# EAGLE board 140182-1-v2.1-j2b-synth (EAGLE 6.6.0)
AUTHOR: CPV; COPYRIGHT: (C) Elektor; NRS: 140182-1; REV: v2.1
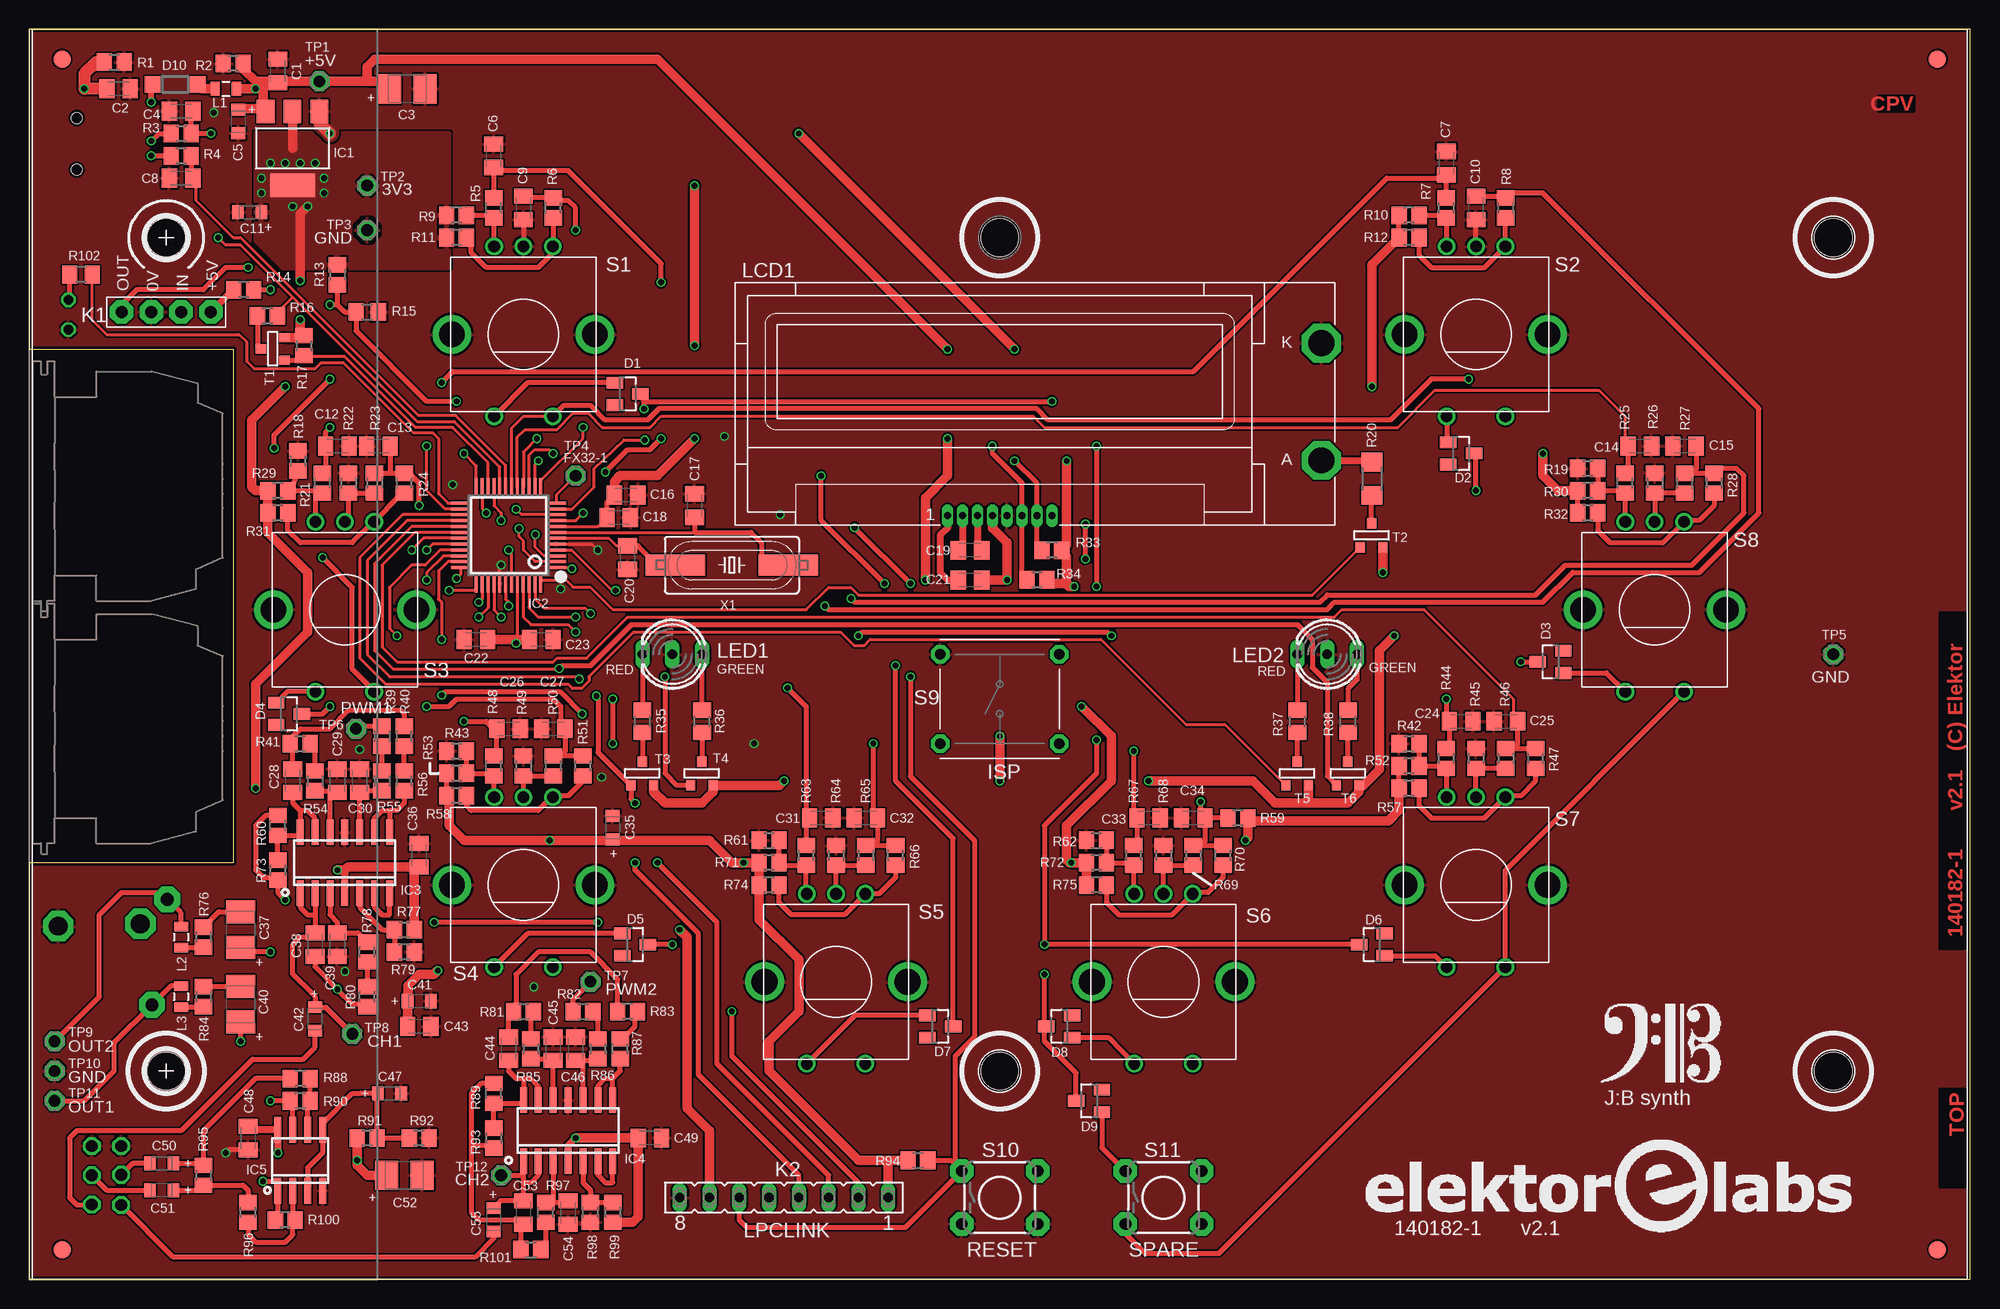
[diagram p6: board, top side]
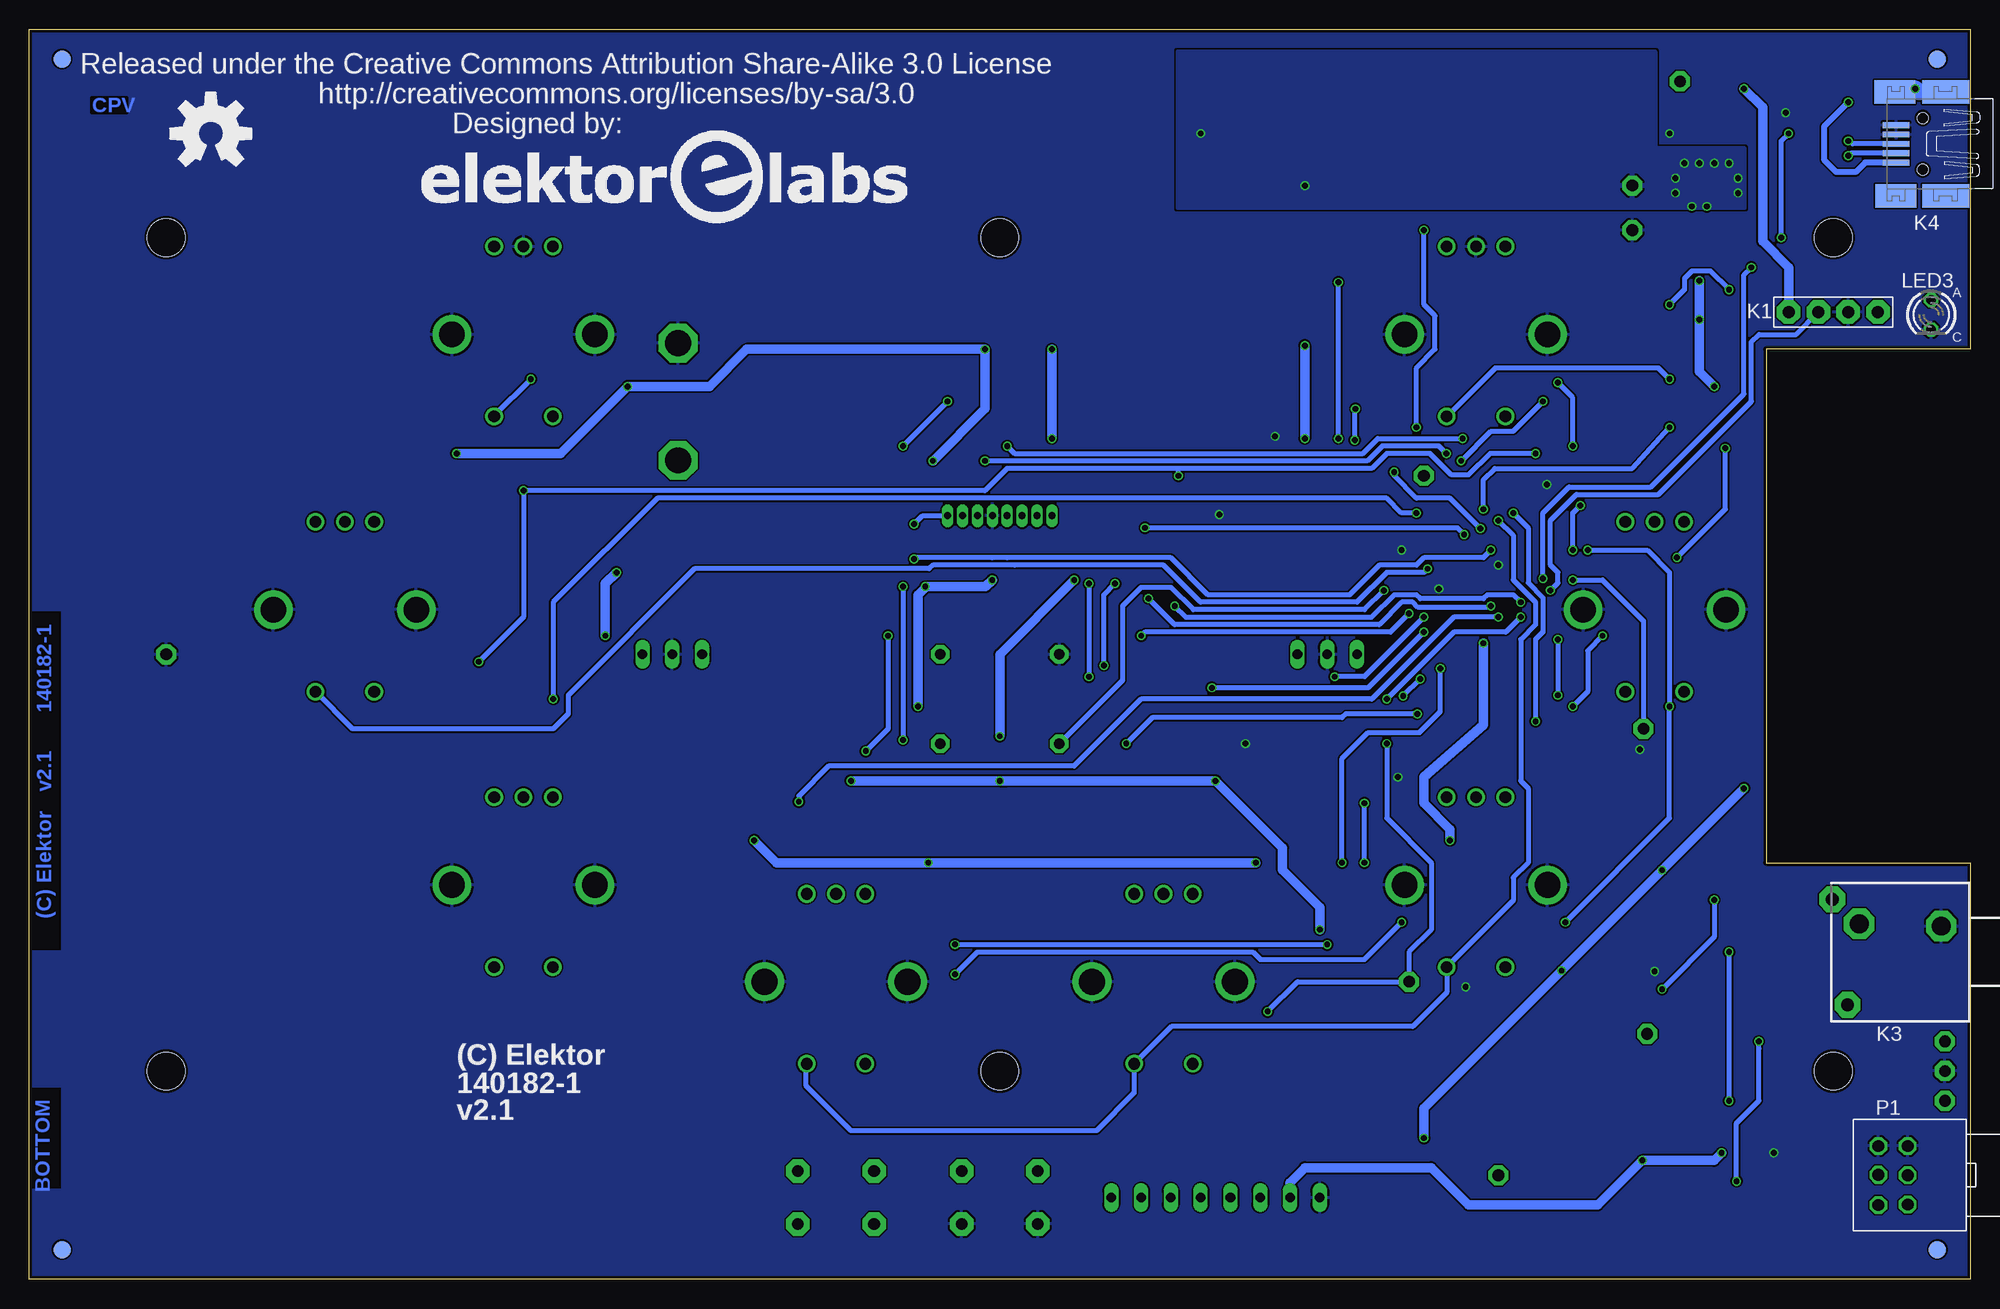
[diagram p7: board, bottom side, seen from below]

Size 165.61 x 106.68 mm. Coordinates in mm from the lower left corner, seen from the top.
Outline: 0,0 165.61,0 165.61,106.68 0,106.68 0,79.38 17.4,79.38 17.4,35.56 0,35.56 0,0
Copper layers (1*16): Top 0.018mm / dielectric 1.55mm / Bottom 0.018mm
Design rules "eC_2Layer_PClass6_BaseCopperO18_eCDefault *": minimum track width 0.15mm, minimum drill 0.35mm, track to track 0.15mm, track to pad 0.15mm, pad to pad 0.15mm, via to via 0.15mm, smd to smd 0mil, copper to edge 0.25mm, drill to drill 0.35mm, minimum pad ring 0.175mm, minimum via ring 0.125mm, stop-mask expansion 0mil, vias tented up to drill 0.55mm, thermal gap 0.2mm
Holes 3.2 mm at 11.68,17.78 82.8,17.78 153.92,17.78 153.92,88.9 11.68,88.9 82.8,88.9

## Footprints (pad centres in the part's own frame; a part is rotated, then mirrored left to right if it is on the bottom)
C0805K = smd 1.3 x 1.6: 1 -1,0; 2 1,0
B/3528-21R = smd 1.95 x 2.5: + 1.525,0; - -1.525,0
SMC_Z = smd 1 x 1.2: + -1,0; - 1,0
SOT23 = smd 1 x 1.4: 1 -0.95,-1.1; 2 0.95,-1.1; 3 0,1.1
SOD123 = smd 1.4 x 1.4: A 1.9,0; C -1.9,0
FIDUCIAL-1.5X3 = smd 1.5 x 1.5: 1 0,0
SOT223 = smd 1.499 x 2.007: 1 -2.261,-3.15; 2 0.025,-3.15; 3 2.311,-3.15 | smd 3.81 x 2.007: 4 0,3.15
LQFP48 = smd 0.254 x 1.6: 1 -2.75,-4.1; 2 -2.25,-4.1; 3 -1.75,-4.1; 4 -1.25,-4.1; 5 -0.75,-4.1; 6 -0.25,-4.1; 7 0.25,-4.1; 8 0.75,-4.1; 9 1.25,-4.1; 10 1.75,-4.1; 11 2.25,-4.1; 12 2.75,-4.1; 25 2.75,4.1; 26 2.25,4.1; 27 1.75,4.1; 28 1.25,4.1; 29 0.75,4.1; 30 0.25,4.1; 31 -0.25,4.1; 32 -0.75,4.1; 33 -1.25,4.1; 34 -1.75,4.1; 35 -2.25,4.1; 36 -2.75,4.1 | smd 1.6 x 0.254: 13 4.1,-2.75; 14 4.1,-2.25; 15 4.1,-1.75; 16 4.1,-1.25; 17 4.1,-0.75; 18 4.1,-0.25; 19 4.1,0.25; 20 4.1,0.75; 21 4.1,1.25; 22 4.1,1.75; 23 4.1,2.25; 24 4.1,2.75; 37 -4.1,2.75; 38 -4.1,2.25; 39 -4.1,1.75; 40 -4.1,1.25; 41 -4.1,0.75; 42 -4.1,0.25; 43 -4.1,-0.25; 44 -4.1,-0.75; 45 -4.1,-1.25; 46 -4.1,-1.75; 47 -4.1,-2.25; 48 -4.1,-2.75
SO14 = smd 0.6 x 2.2: 1 -3.81,-2.6; 2 -2.54,-2.6; 3 -1.27,-2.6; 4 0,-2.6; 5 1.27,-2.6; 6 2.54,-2.6; 7 3.81,-2.6; 8 3.81,2.6; 9 2.54,2.6; 10 1.27,2.6; 11 0,2.6; 12 -1.27,2.6; 13 -2.54,2.6; 14 -3.81,2.6
SO08 = smd 0.6 x 2.2: 1 -1.905,-2.6; 2 -0.635,-2.6; 3 0.635,-2.6; 4 1.905,-2.6; 5 1.905,2.6; 6 0.635,2.6; 7 -0.635,2.6; 8 -1.905,2.6
140182-2-MIDI_BOARD = drill 1.016 pad 2 octagon: 1 24.13,7.62; 2 24.13,10.16; 3 24.13,12.7; 4 24.13,15.24
FE08 = drill 0.813 long: 1 -8.89,0; 2 -6.35,0; 3 -3.81,0; 4 -1.27,0; 5 1.27,0; 6 3.81,0; 7 6.35,0; 8 8.89,0
EPP-JACK-35 = drill 1.6 pad 2.6 octagon: B -2.4,-3.5; S -2.2,3.5 | drill 1.1 pad 2.2 octagon: R -4.5,-5.8; T 4.5,-4.5
USB-MINI-B = smd 2.25 x 0.5: 1 2.275,1.6; 2 2.275,0.8; 3 2.275,0; 4 2.275,-0.8; 5 2.275,-1.6 | smd 4 x 2: M1 -1.95,-4.45; M2 -1.95,4.45 | smd 3.5 x 2: M3 2.3,4.45; M4 2.4,-4.45 | hole 0.9: 0,2.2; 0,-2.2
0805 = smd 0.8 x 1.2: 1 -0.9,0; 2 0.9,0
LCD-MIDAS-I2C = drill 0.6 pad 1 long: 1 -4.445,-12.3; 2 -3.175,-12.3; 3 -1.905,-12.3; 4 -0.635,-12.3; 5 0.635,-12.3; 6 1.905,-12.3; 7 3.175,-12.3; 8 4.445,-12.3 | drill 2.2 octagon: A 27.45,-7.575; K 27.45,2.425
DUOLED-C-5MM = drill 0.813 long: AR 2.54,0; AX -2.54,0; C 0,0
LED3MM = drill 0.813 octagon: A -1.27,0; K 1.27,0
POT-BOURNS-PTD90-2-WAY = drill 1 octagon: 1 0,-2.5; 2 0,0; 3 0,2.5; 4 -2.5,-2.54; 5 -2.5,0.04; 6 -2.5,2.5
R0805 = smd 1.3 x 1.5: 1 -0.85,0; 2 0.85,0
R0805' = smd 1.3 x 1.5: 1 -0.95,0; 2 0.95,0
R1206 = smd 1.6 x 1.803: 1 -1.422,0; 2 1.422,0
ALPS_EC12E_SW = drill 1: A -2.5,-7.5; B 2.5,-7.5; C 0,-7.5; D -2.5,7; E 2.5,7 | drill 2.2: GND1 -6.1,0; GND2 6.1,0
PUSHBUTTON_MULTIMEC = drill 0.9 pad 1.6 octagon: 1 5.08,3.81; 2 -5.08,3.81; 3 5.08,-3.81; 4 -5.08,-3.81
EPP-S-TACT-6X6 = drill 1 pad 2 octagon: 1 -3.25,2.25; 2 3.25,2.25; 3 -3.25,-2.25; 4 3.25,-2.25
SOT-23 = smd 0.787 x 0.889: 1 0.025,-1.016; 2 -0.94,1.016; 3 0.991,1.016
P1-13 = drill 1 pad 1.7 octagon: TP 0,0
SM49 = smd 5.08 x 1.778: 1 -4.826,0; 2 4.826,0

## Placement (x,y rotation side)
BOX1  ENCLOSURE-HAMMOND-1597D  [HAMMOND-1597DGY]  82.8,53.34 0 top
C1  100n  [C0805K]  21.21,103.12 270 top
C2  nc  [C0805K]  7.62,101.6 0 top
C3  100u 6V3  [B/3528-21R]  32.26,101.6 180 top
C4  18p  [C0805K]  12.95,99.69 180 top
C5  10u 6V3  [SMC_Z]  17.83,98.81 270 top
C6  10n  [C0805K]  39.62,95.89 270 top
C7  10n  [C0805K]  120.9,95.25 270 top
C8  18p  [C0805K]  12.95,93.98 180 top
C9  10n  [C0805K]  42.16,91.44 90 top
C10  10n  [C0805K]  123.44,91.44 90 top
C11  10u 6V3  [SMC_Z]  18.8,91.06 180 top
C12  10n  [C0805K]  26.29,71.12 180 top
C13  10n  [C0805K]  29.78,71.12 0 top
C14  10n  [C0805K]  137.41,71.12 180 top
C15  10n  [C0805K]  141.22,71.12 0 top
C16  100n  [C0805K]  50.93,66.93 180 top
C17  18p  [C0805K]  56.77,66.04 270 top
C18  10n  [C0805K]  50.29,65.02 180 top
C19  1u  [C0805K]  80.26,62.23 180 top
C20  18p  [C0805K]  51.05,61.6 90 top
C21  1u  [C0805K]  80.26,59.69 0 top
C22  100n  [C0805K]  38.1,54.61 0 top
C23  10n  [C0805K]  43.69,54.61 180 top
C24  10n  [C0805K]  122.17,47.62 180 top
C25  10n  [C0805K]  125.98,47.62 0 top
C26  10n  [C0805K]  40.89,46.99 180 top
C27  10n  [C0805K]  44.7,46.99 0 top
C28  15nF  [C0805K]  22.48,42.55 270 top
C29  680p  [C0805K]  26.29,42.55 90 top
C30  680p  [C0805K]  28.19,42.55 90 top
C31  10n  [C0805K]  67.56,39.37 180 top
C32  10n  [C0805K]  71.37,39.37 0 top
C33  10n  [C0805K]  95.5,39.37 180 top
C34  10n  [C0805K]  99.31,39.37 0 top
C35  10u 6V3  [SMC_Z]  49.78,38.54 90 top
C36  100n  [C0805K]  33.27,36.2 90 top
C37  100u 6V3  [B/3528-21R]  18.03,29.85 270 top
C38  220n  [C0805K]  24.38,28.58 90 top
C39  680p  [C0805K]  26.29,28.58 270 top
C40  100u 6V3  [B/3528-21R]  18.03,23.5 270 top
C41  10u 6V3  [SMC_Z]  33.27,23.75 0 top
C42  10u 6V3  [SMC_Z]  24.38,22.23 270 top
C43  10n  [C0805K]  33.27,21.59 180 top
C44  15nF  [C0805K]  40.89,19.69 270 top
C45  680p  [C0805K]  44.7,19.69 90 top
C46  680p  [C0805K]  46.61,19.69 90 top
C47  10u 6V3  [SMC_Z]  30.73,15.88 0 top
C48  100n  [C0805K]  18.67,12.07 270 top
C49  100n  [C0805K]  52.96,12.07 0 top
C50  10u 6V3  [SMC_Z]  11.3,9.91 180 top
C51  10u 6V3  [SMC_Z]  11.3,7.62 180 top
C52  100u 6V3  [B/3528-21R]  32,8.89 180 top
C53  220n  [C0805K]  42.16,5.72 90 top
C54  680p  [C0805K]  45.97,5.72 270 top
C55  10u 6V3  [SMC_Z]  39.62,5.08 270 top
D1  BAT54  [SOT23]  51.05,75.56 270 top
D2  BAT54  [SOT23]  122.17,70.48 270 top
D3  BAT54  [SOT23]  129.79,52.71 90 top
D4  BAT54  [SOT23]  22.16,48.26 270 top
D5  BAT54  [SOT23]  51.69,28.58 270 top
D6  BAT54  [SOT23]  114.55,28.58 90 top
D7  BAT54  [SOT23]  77.72,21.59 270 top
D8  BAT54  [SOT23]  87.88,21.59 90 top
D9  BAT54  [SOT23]  90.42,15.24 90 top
D10  MBR0540T1G  [SOD123]  12.45,101.98 180 top
FID1  FIDUCIAL1.5X3  [FIDUCIAL-1.5X3]  2.79,104.14 0 top
FID2  FIDUCIAL1.5X3  [FIDUCIAL-1.5X3]  162.81,104.14 0 top
FID3  FIDUCIAL1.5X3  [FIDUCIAL-1.5X3]  2.79,2.54 0 top
FID4  FIDUCIAL1.5X3  [FIDUCIAL-1.5X3]  162.81,2.54 0 top
FID5  FIDUCIAL1.5X3  [FIDUCIAL-1.5X3]  2.79,2.54 0 bottom
FID6  FIDUCIAL1.5X3  [FIDUCIAL-1.5X3]  162.81,2.54 0 bottom
FID7  FIDUCIAL1.5X3  [FIDUCIAL-1.5X3]  2.79,104.14 0 bottom
FID8  FIDUCIAL1.5X3  [FIDUCIAL-1.5X3]  162.81,104.14 0 bottom
IC1  REG1117  [SOT223]  22.48,96.52 180 top
IC2  LPC1347FDB48  [LQFP48]  40.89,63.5 90 top
IC3  MCP6004  [SO14]  26.92,35.56 0 top
IC4  MCP6004  [SO14]  45.97,12.7 0 top
IC5  TDA1308  [SO08]  23.11,10.16 0 top
K1  140182-2-MIDI-BOARD  [140182-2-MIDI_BOARD]  0.25,106.68 270 top
K2  LPC-Link  [FE08]  64.39,6.99 180 top
K3  Jack stereo 3.5mm  [EPP-JACK-35]  5.97,27.94 270 bottom
K4  Mini USB-B shielded  [USB-MINI-B]  4.05,96.9 180 bottom
L1  BLM21AG601SN1D  [0805]  16.76,101.6 0 top
L2  BLM21AG601SN1D  [0805]  12.95,29.21 270 top
L3  BLM21AG601SN1D  [0805]  12.95,24.13 270 top
LCD1  [LCD-MIDAS-I2C]  82.8,77.47 0 top
LED1  L-59EGW  [DUOLED-C-5MM]  54.86,53.34 180 top
LED2  L-59EGW  [DUOLED-C-5MM]  110.74,53.34 180 top
LED3  [LED3MM]  3.33,82.32 270 bottom
LOGO1  LOGO-ELEKTOR-LABS-42MM  [EPP-LOGO-ELEKTOR-LABS-42MM]  112.97,3.81 0 top
LOGO2  LOGO-ELEKTOR-LABS-42MM  [EPP-LOGO-ELEKTOR-LABS-42MM]  133.22,89.92 0 bottom
P1  [POT-BOURNS-PTD90-2-WAY]  5.33,8.89 0 bottom
R1  0R  [R0805]  7.24,103.89 0 top
R2  100k  [R0805]  17.4,103.76 180 top
R3  33R  [R0805]  12.95,97.79 0 top
R4  33R  [R0805]  12.95,95.89 0 top
R5  10k  [R0805]  39.62,91.44 90 top
R6  10k  [R0805]  44.7,91.44 90 top
R7  10k  [R0805]  120.9,91.44 90 top
R8  10k  [R0805]  125.98,91.44 90 top
R9  10k  [R0805]  36.45,90.81 180 top
R10  10k  [R0805]  117.73,90.81 180 top
R11  10k  [R0805]  36.45,88.9 180 top
R12  10k  [R0805]  117.73,88.9 180 top
R13  100k  [R0805]  26.29,85.72 270 top
R14  1k  [R0805]  18.29,84.45 180 top
R15  NC  [R0805']  28.83,82.55 0 top
R16  1k5  [R0805]  20.32,82.23 0 top
R17  1M  [R0805]  23.43,79.69 270 top
R18  nc  [R0805]  22.92,69.85 270 top
R19  nc  [R0805]  132.97,69.22 0 top
R20  47R  [R1206]  114.55,68.33 90 top
R21  10k  [R0805]  25.02,67.95 90 top
R22  0R  [R0805]  27.24,67.95 270 top
R23  nc  [R0805]  29.46,67.95 270 top
R24  10k  [R0805]  32,67.95 90 top
R25  10k  [R0805]  136.14,67.95 90 top
R26  0R  [R0805]  138.68,67.95 270 top
R27  nc  [R0805]  141.22,67.95 270 top
R28  10k  [R0805]  143.76,67.95 90 top
R29  10k  [R0805]  21.21,67.31 180 top
R30  10k  [R0805]  132.97,67.31 180 top
R31  10k  [R0805]  21.21,65.41 180 top
R32  10k  [R0805]  132.97,65.41 180 top
R33  4k7  [R0805]  87.25,62.23 180 top
R34  4k7  [R0805]  85.98,59.69 180 top
R35  270R  [R0805']  52.32,47.62 90 top
R36  220R  [R0805']  57.4,47.62 90 top
R37  270R  [R0805']  108.2,47.62 90 top
R38  220R  [R0805']  112.52,47.62 90 top
R39  82k  [R0805]  30.1,46.36 270 top
R40  180R  [R0805]  32,46.36 90 top
R41  8k2  [R0805]  23.11,45.72 0 top
R42  nc  [R0805]  117.73,45.72 0 top
R43  nc  [R0805]  36.45,45.09 0 top
R44  10k  [R0805]  120.9,44.45 90 top
R45  0R  [R0805]  123.44,44.45 270 top
R46  nc  [R0805]  125.98,44.45 270 top
R47  10k  [R0805]  128.52,44.45 90 top
R48  10k  [R0805]  39.62,43.82 90 top
R49  0R  [R0805]  42.16,43.82 270 top
R50  nc  [R0805]  44.7,43.82 270 top
R51  10k  [R0805]  47.24,43.82 90 top
R52  10k  [R0805]  117.73,43.82 180 top
R53  10k  [R0805]  36.45,43.18 180 top
R54  270R  [R0805]  24.38,42.55 270 top
R55  6k8  [R0805]  30.1,42.55 270 top
R56  3k3  [R0805]  32,42.55 90 top
R57  10k  [R0805]  117.73,41.91 180 top
R58  10k  [R0805]  36.45,41.28 180 top
R59  100k  [R0805]  103.12,39.37 180 top
R60  820R  [R0805]  21.21,38.73 90 top
R61  nc  [R0805]  63.12,37.47 0 top
R62  nc  [R0805]  91.06,37.47 0 top
R63  10k  [R0805]  66.29,36.2 90 top
R64  0R  [R0805]  68.83,36.2 270 top
R65  nc  [R0805]  71.37,36.2 270 top
R66  10k  [R0805]  73.91,36.2 90 top
R67  10k  [R0805]  94.23,36.2 90 top
R68  0R  [R0805]  96.77,36.2 270 top
R69  nc  [R0805]  99.31,36.2 270 top
R70  10k  [R0805]  101.85,36.2 90 top
R71  10k  [R0805]  63.12,35.56 180 top
R72  10k  [R0805]  91.06,35.56 180 top
R73  6k8  [R0805]  21.21,34.93 270 top
R74  10k  [R0805]  63.12,33.66 180 top
R75  10k  [R0805]  91.06,33.66 180 top
R76  10R  [R0805]  14.86,29.21 270 top
R77  100k  [R0805]  32,29.85 0 top
R78  100R  [R0805]  28.83,27.94 90 top
R79  100k  [R0805]  32,27.94 180 top
R80  1k  [R0805]  28.83,24.13 90 top
R81  8k2  [R0805]  42.16,22.86 0 top
R82  82k  [R0805]  47.24,22.86 0 top
R83  180R  [R0805]  51.05,22.86 180 top
R84  10R  [R0805]  14.86,24.13 270 top
R85  270R  [R0805]  42.8,19.69 270 top
R86  6k8  [R0805]  48.51,19.69 270 top
R87  3k3  [R0805]  50.42,19.69 90 top
R88  3k3  [R0805]  23.11,17.15 180 top
R89  820R  [R0805]  39.62,15.88 90 top
R90  3k3  [R0805]  23.11,15.24 180 top
R91  10k  [R0805]  28.83,12.07 180 top
R92  10k  [R0805]  33.27,12.07 180 top
R93  6k8  [R0805]  39.62,12.07 270 top
R94  100k  [R0805]  75.82,10.16 0 top
R95  nc  [R0805]  14.86,8.89 270 top
R96  3k3  [R0805]  18.67,5.72 90 top
R97  100R  [R0805]  44.07,5.72 90 top
R98  100k  [R0805]  47.88,5.72 90 top
R99  100k  [R0805]  49.78,5.72 270 top
R100  3k3  [R0805]  21.84,5.08 180 top
R101  1k  [R0805]  42.8,2.54 0 top
R102  270R  [R0805']  4.41,85.74 180 top
S1  EC12E_SW  [ALPS_EC12E_SW]  42.16,80.65 180 top
S2  EC12E_SW  [ALPS_EC12E_SW]  123.44,80.65 180 top
S3  EC12E_SW  [ALPS_EC12E_SW]  26.92,57.15 180 top
S4  EC12E_SW  [ALPS_EC12E_SW]  42.16,33.66 180 top
S5  EC12E_SW  [ALPS_EC12E_SW]  68.83,25.4 180 top
S6  EC12E_SW  [ALPS_EC12E_SW]  96.77,25.4 180 top
S7  EC12E_SW  [ALPS_EC12E_SW]  123.44,33.66 180 top
S8  EC12E_SW  [ALPS_EC12E_SW]  138.68,57.15 180 top
S9  Multimec  [PUSHBUTTON_MULTIMEC]  82.8,49.53 180 top
S10  [EPP-S-TACT-6X6]  82.8,6.99 0 top
S11  [EPP-S-TACT-6X6]  96.77,6.99 0 top
T1  BSS84P  [SOT-23]  20.76,79.44 270 top
T2  BSS84P  [SOT-23]  114.55,63.5 180 top
T3  BSS84P  [SOT-23]  52.32,43.18 180 top
T4  BSS84P  [SOT-23]  57.4,43.18 180 top
T5  BSS84P  [SOT-23]  108.2,43.18 180 top
T6  BSS84P  [SOT-23]  112.52,43.18 180 top
TP1  TPPAD1-13  [P1-13]  24.77,102.24 0 top
TP2  TPPAD1-13  [P1-13]  28.83,93.34 0 top
TP3  TPPAD1-13  [P1-13]  28.83,89.53 0 top
TP4  TPPAD1-13  [P1-13]  46.61,68.58 180 top
TP5  TPPAD1-13  [P1-13]  153.92,53.34 0 top
TP6  TPPAD1-13  [P1-13]  27.88,46.99 180 top
TP7  TPPAD1-13  [P1-13]  47.88,25.4 180 top
TP8  TPPAD1-13  [P1-13]  27.56,20.96 180 top
TP9  TPPAD1-13  [P1-13]  2.16,20.32 90 top
TP10  TPPAD1-13  [P1-13]  2.16,17.78 180 top
TP11  TPPAD1-13  [P1-13]  2.16,15.24 180 top
TP12  TPPAD1-13  [P1-13]  40.26,8.89 180 top
U$1  OSHW-LOGOL  [OSHW-LOGO-L]  150.11,97.79 0 bottom
U$2  CREATIVE_COMMONS  [CREATIVE_COMMONS]  140.97,97.79 0 bottom
X1  12 MHz  [SM49]  59.94,60.96 0 top

## Tracks (layer width: path | path; a pad name or v marks a point on that pad's centre or on a via)
!GREEN_LED1!  (via drill 0.5)
  Top 0.254: IC2.46 42.64,57.31 43.43,56.52 v46.61,56.52
  Top 0.406: v54.23,51.44 54.23,43.18 55.25,42.16 T4.3
  Bottom 0.406: v46.61,56.52 51.69,51.44 v54.23,51.44
!GREEN_LED2!/SWCLK  (via drill 0.5)
  Top 0.254: IC2.29 32.63,64.25 29.46,61.09 29.46,53.66 31.05,52.07 45.15,52.07 v45.21,52.13
  Top 0.406: K2.3 68.2,8.89 58.67,18.42 58.67,30.48 v53.59,35.56 | v45.21,52.13 45.47,52.39 47.88,52.39 51.37,55.88 108.2,55.88 109.47,54.61 109.47,52.2 110.74,50.93 110.74,42.95 T6.3
  Bottom 0.406: v53.59,35.56 53.59,44.45 51.37,46.67 46.99,46.67 45.21,48.45 v45.21,52.13
!LCD_BL
  Top 0.254: IC2.48 43.64,59.58 43.75,59.69 45.79,59.69 46.4,59.08 47.85,59.08 49.78,57.15 66.29,57.15 68.2,59.06 70.1,59.06 70.74,58.42 109.5,58.42 T2.3
!RED_LED1!/SWO  (via drill 0.5)
  Top 0.254: IC2.28 32.24,64.75 28.83,61.34 28.83,53.34 30.73,51.44 46.8,51.44 v46.93,51.25
  Top 0.406: v48.39,49.78 48.51,49.53 48.51,44.98 T3.3 51.33,41 v51.69,40.64 | K2.4 65.66,8.89 57.09,17.46 57.09,29.53 51.69,34.93 v51.69,35.56
  Bottom 0.406: v46.93,51.25 v48.39,49.78 | v51.69,35.56 v51.69,40.64
!RED_LED2
  Top 0.254: IC2.27 31.85,65.25 28.19,61.6 28.19,53.02 30.42,50.8 45.97,50.8 46.36,50.42 47.12,50.42 47.75,51.05 47.75,51.44 51.56,55.25 69.22,55.25 70.36,54.1 71.25,54.1 71.75,54.61 91.44,54.61 98.68,47.37 102.01,47.37 T5.3
!RESET  (via drill 0.5)
  Top 0.254: IC2.3 43.91,61.75 43.18,62.48 v43.18,63.56
  Top 0.406: K2.6 60.58,5.08 61.21,4.45 74.76,4.45 S10.1 | R94.2 78.63,10.16 S10.1 | v70.42,64.14 v75.18,59.37 | v75.18,51.44 75.18,42.93 80.64,37.47 80.64,20.7 78.99,19.05 78.99,9.8 S10.1
  Bottom 0.406: v43.18,63.56 43.75,64.14 v70.42,64.14 | v75.18,59.37 v75.18,51.44
!USB_CONNECT
  Top 0.254: IC2.22 39.14,69.7 36.13,72.71 32.96,72.71 26.92,78.74 23.53,78.74 R17.2
  Top 0.406: T1.3 23.04,78.45 R17.2
+3V3  (via drill 0.5)
  Top 0.254: IC2.8 48.52,64.25 C18.2 | IC2.44 41.64,54.73 41.73,54.73 41.85,54.61
  Top 0.406: R58.2 R53.2 | R57.2 R52.2 | R32.2 R30.2 | R12.2 R10.2 | 23.27,80.38 R17.1 23.22,80.54 23.11,80.65 | C18.2 49.29,66.29 C16.2
  Top 0.61: v46.61,12.07 45.97,11.43 IC4.4 | 26.92,34.93 IC3.4
  Top 0.813: 22.45,93.4 IC1.4 23.05,93.94 | R34.1 87.25,59.37 88.52,59.37 | 88.52,59.37 88.52,61.7 R33.1 88.52,62.65 v88.52,69.85 | T1.2 23.27,80.38 | 23.11,80.65 v23.11,81.92 | R57.2 116.88,40.43 116.88,40.04 115.95,39.12 104.23,39.12 R59.1 103.97,37.68 v103.76,37.47 | R58.2 35.81,41.7 35.81,38.73 37.08,37.47 v44.39,37.47 49.71,37.47 C35.+ 49.86,37.47 58.04,37.47 59.94,35.56 v60.96,35.56 R71.2 R74.2 62.27,30.7 65.66,27.31 65.66,22.86 63.12,20.32 63.12,17.78 70.74,10.16 73.28,10.16 | R12.2 114.55,86.58 v114.55,76.2 | v129.16,70.48 129.16,68.58 130.43,67.31 R30.2 | v46.61,12.07 C49.1 51.96,5.35 51.47,4.87 R99.2 | R77.2 32.85,34.78 C36.1 27.19,35.2 26.92,34.93 v26.29,34.93 | IC1.2 22.45,96.55 22.48,96.52 | v23.11,85.22 23.11,90.93 v23.75,91.57 | v19.3,41.91 19.3,50.8 23.75,55.25 23.75,60.33 20.36,63.72 R31.2 R29.2 19.3,67.31 18.99,67.63 18.99,73.34 v21.84,76.2 | C43.2 C41.+ 32.33,25.1 33.27,26.04 34.54,26.04 v34.86,26.35 | 73.28,10.16 R94.1 | K2.1 73.28,10.16 | C16.2 49.93,68.09 50.42,68.58 53.59,68.58 v56.77,71.75 | v56.77,79.69 v56.77,93.34 | v89.79,48.9 92.33,46.36 92.33,42.55 88.52,38.73 88.52,35.81 88.77,35.56 v88.9,35.56 R72.2 R75.2 | v89.15,59.12 88.71,59.12 88.52,59.31 88.52,59.37 | v84.07,79.38 v65.66,97.79 | C22.2 41.85,54.61 | 41.85,54.61 C23.2 | v41.53,54.29 41.85,54.61 | LCD1.4 82.17,64.14 83.44,62.87 v83.44,59.69 C21.2
  Bottom 0.813: v23.11,85.22 v23.11,81.92 23.11,77.47 v21.84,76.2 | v60.96,35.56 v88.9,35.56 101.85,35.56 v103.76,37.47 | v129.16,70.48 120.27,70.48 v114.55,76.2 107.57,76.2 104.39,79.38 v84.07,79.38 84.07,74.3 v88.52,69.85 | v19.3,41.91 v26.29,34.93 v34.86,26.35 46.61,14.61 v46.61,12.07 | v56.77,79.69 v56.77,71.75 | v89.79,48.9 89.79,58.42 89.15,59.06 v89.15,59.12 84.01,59.12 v83.44,59.69 | v41.53,54.29 41.53,47.31 46.61,42.86 46.61,40.64 44.39,38.42 v44.39,37.47
  other vias: 25.15,92.71 20.57,95.25 21.84,95.25 23.11,95.25 24.38,95.25 19.81,93.98 25.15,93.98 22.48,91.57 19.81,92.71
  pour Top (isolate 0.406): 19.3,97.79 19.3,86.36 35.81,86.36 35.81,97.79
  pour Bottom (isolate 0.406): 26.92,104.78 26.92,96.52 19.3,96.52 19.3,91.44 67.56,91.44 67.56,104.78
+5V  (via drill 0.5)
  Top 0.406: R14.2 17.4,84.45 | 18.97,12.76 C48.1
  Top 0.61: 17.4,84.45 K1.4 | 18.97,12.76 IC5.8 v21.21,10.8
  Top 0.813: C1.2 20.69,102.24 TP1.TP 28.83,102.24 | C1.2 20.46,102.12 19.94,101.6 | 19.94,101.6 19.94,99.9 | 19.94,99.9 IC1.3 | R2.1 18.25,103.29 19.3,102.24 20.46,102.24 C1.2 | L1.2 v19.3,101.6 19.94,101.6 | 19.94,99.9 18.23,99.9 C5.+ | T3.2 53.26,41.61 54.23,40.64 57.4,40.64 58.34,41.58 T4.2 64.01,42.16 v64.39,42.55 | v95.5,42.55 104.39,42.55 106.3,40.64 108.97,40.64 | T2.2 115.51,62.15 v115.51,60.33 | v116.46,54.93 115.19,53.66 115.19,43.5 113.84,42.15 T6.2 113.46,41.58 112.52,40.64 108.97,40.64 | R91.2 v27.98,10.16 27.98,9.74 28.83,8.89 C52.+ | K2.7 58.04,12.7 56.13,14.61 56.13,29.21 v55.5,29.85 | v78.36,79.38 53.59,104.14 29.46,104.14 28.83,103.5 28.83,102.24 | v78.36,71.75 78.36,68.58 76.45,66.68 v76.45,59.69 | v82.8,46.36 v82.8,42.55 | T5.2 109.14,40.82 108.97,40.64 | 28.83,102.24 30.1,102.24 C3.+
  Bottom 0.813: K1.4 15.49,86.36 17.72,88.58 17.72,100.01 v19.3,101.6 | 82.17,42.55 v64.39,42.55 58.67,36.83 58.67,34.93 55.5,31.75 v55.5,29.85 | 82.17,42.55 v82.8,42.55 | v82.8,42.55 v95.5,42.55 | v115.51,60.33 116.46,59.37 v116.46,54.93 | v21.21,10.8 21.84,10.16 v27.98,10.16 31.79,6.35 42.8,6.35 45.97,9.53 56.77,9.53 58.04,8.26 K2.7 | v78.36,71.75 v78.36,79.38 | v76.45,59.69 82.8,53.34 v82.8,46.36 | v82.8,42.55 82.17,42.55
CH1
  Top 0.406: IC3.2 24.38,31.12 | 24.38,31.12 C38.2 24.02,29.21 23.11,29.21 22.48,28.58 22.48,26.04 24.08,24.44 24.38,24.13 C42.+ 25.29,23.23 TP8.TP | IC3.1 23.11,31.75 23.75,31.12 24.38,31.12
CH2
  Top 0.406: IC4.2 43.43,8.89 42.8,8.26 42.16,8.26 | 42.16,8.26 42.16,8.89 | 42.16,8.89 IC4.1 | 42.16,8.26 C53.2 40.2,6.72 C55.+ | TP12.TP 42.16,8.89
COL0  (via drill 0.5)
  Top 0.254: IC2.11 46.32,65.75 48.2,67.63 48.2,69.22 50.74,71.63 v52.51,71.63 | 52.32,75.4 D1.3
  Top 0.406: v52.45,74.3 52.45,74.93 | 52.45,74.93 52.32,75.4 | D6.3 v86.61,28.58 86.61,38.73 91.06,43.18 v91.06,46.04 | v54.86,28.58 D5.3 | 52.45,74.93 v87.25,74.93 | v91.06,71.12 v91.06,59.12
  Bottom 0.406: v52.51,71.63 52.51,74.04 v52.45,74.3 | v86.61,28.58 v54.86,28.58 | v87.25,74.93 v91.06,71.12 | v91.06,59.12 v91.06,46.04
COL1  (via drill 0.5)
  Top 0.254: IC2.24 38.14,69.43 v37.08,70.48 | 123.44,70.31 D2.3
  Top 0.406: v123.44,67.31 123.44,70.31 | D7.3 78.82,37.64 73.91,42.55 v73.91,52.39 | v72.96,59.37 67.56,64.77 v67.56,68.58 | v127.25,52.71 D3.3
  Bottom 0.406: v37.08,70.48 40.96,70.48 42.8,68.64 44.26,68.64 46.1,70.48 49.78,70.48 51.05,69.22 67.56,69.22 | 67.56,69.22 82.17,69.22 84.07,67.31 v123.44,67.31 123.44,56.52 v127.25,52.71 | v73.91,52.39 73.91,58.42 v72.96,59.37 | v67.56,68.58 67.56,69.22
COL2  (via drill 0.5)
  Top 0.254: IC2.31 33.66,63.25 v32.64,62.23
  Top 0.406: D9.3 89.32,17.61 86.61,20.32 86.61,21.42 | 86.61,21.42 D8.3 | D4.3 25.02,48.26 v25.65,48.9 | 86.61,21.42 v86.61,26.04 | v48.51,30.48 v34.54,30.48
  Bottom 0.406: v32.64,62.23 27.56,62.23 25.65,60.33 v25.65,48.9 25.65,39.37 v34.54,30.48 | v86.61,26.04 84.71,27.94 61.21,27.94 60.58,27.31 51.69,27.31 v48.51,30.48
DNEG  (via drill 0.5)
  Top 0.406: v10.41,95.89 R4.1
  Bottom 0.406: K4.2 10.2,96.1 v10.41,95.89
DPOS  (via drill 0.5)
  Top 0.406: v10.41,97.16 11.05,97.79 R3.1
  Bottom 0.406: K4.3 10.03,96.9 v10.41,97.16
FX32-1
  Top 0.254: IC2.12 44.99,66.97 TP4.TP
GND  (via drill 0.5)
  Top 0.254: IC2.5 47.99,62.75 v48.51,62.23 | IC2.41 40.14,60.85 v40.26,60.96
  Top 0.406: C9.1 S1.C | S2.C C10.1 | C48.2 17.03,11.07 v16.76,10.8
  Top 0.813: C23.1 44.69,54.63 44.39,54.93
  Top 1.016: IC1.1 24.74,98.7 v25.65,97.79
  other vias: 43.05,24.96 28.19,45.21 45.34,58.93 26.92,26.29 15.75,99.57 64.07,65.28 59.31,71.95 61.85,45.72 36.13,67.82 48.83,42.86
  pour Bottom (rank 2): 0.25,0 0.25,35.56 17.4,35.56 17.4,79.38 0.25,79.38 0.25,106.68 165.35,106.68 165.35,57.15 162.81,57.15 162.81,27.94 165.35,27.94 165.35,16.51 162.81,16.51 162.81,7.62 165.35,7.62 165.35,0
  pour Top (rank 2): 0.25,0 165.35,0 165.35,7.62 162.81,7.62 162.81,16.51 165.35,16.51 165.35,27.94 162.81,27.94 162.81,57.15 165.35,57.15 165.35,106.68 0.25,106.68 0.25,79.38 17.4,79.38 17.4,35.56 0.25,35.56
HPIN1
  Top 0.406: 14.44,7.62 R95.2 | R95.2 18.25,8.04 18.67,7.62 R96.2 | C51.+ 14.44,7.62 | 14.44,7.62 R95.2
HPIN2
  Top 0.406: 14.64,9.53 R95.1 | R88.2 19.3,17.15 14.86,12.7 R95.1 | C50.+ 14.69,9.91 R95.1
LCD_RST  (via drill 0.5)
  Top 0.254: IC2.43 41.14,61.98 v40.89,62.23
  Top 0.406: v90.11,61.47 v90.11,64.45
  Bottom 0.406: v40.89,62.23 41.53,61.6 46.61,61.6 47.24,60.96 50.42,60.96 52.96,58.42 65.02,58.42 68.2,61.6 82.17,61.6 83.44,61.6 89.92,61.6 v90.11,61.47 | v90.11,64.45 89.39,65.17 LCD1.8
MIDI_LED
  Top 0.254: 5.33,85.72 5.33,81.92 6.6,80.65 17.91,80.65 18.54,80.01 18.54,78.36 19.18,77.72 24.38,77.72 24.89,78.23 26.8,78.23 32.77,72.26 34.42,72.26 34.93,71.75 34.93,67.06 35.73,66.25 IC2.25
  Top 0.406: R102.1 5.33,85.72
N$1
  Top 0.406: D9.1 91.52,11.24 S11.1
N$2
  Top 0.406: R36.2 LED1.AX
N$3
  Top 0.406: R36.1 57.4,44.22 T4.1
N$4
  Top 0.254: IC2.6 49.45,63.25 50.1,62.6 C20.2
  Top 0.406: C20.2 51.96,62.6 53.59,60.96 X1.1
N$5
  Top 0.254: IC2.7 56.77,63.75
  Top 0.406: X1.2 64.77,61.6 62.48,61.6 62.48,62.87 61.6,63.75 56.77,63.75 C17.2
N$6
  Top 0.813: D10.C 14.73,101.6 L1.1
N$7
  Top 0.406: IC5.2 22.48,5.3 R100.1 22.48,4.87 22.48,3.81 21.84,3.18 19.3,3.18 18.67,3.81 R96.1
N$8
  Top 0.61: LCD1.1 78.36,64.14 77.72,63.5 77.72,60.33 78.36,59.69 C21.1
N$9  (via drill 0.5)
  Top 1.016: C2.1 v4.7,101.6 4.7,102.87 5.72,103.89 R1.1
  Bottom 1.422: K4.M4 4.95,101.35 v4.7,101.6 4.45,101.35 K4.M1
N$10  (via drill 0.5)
  Top 0.406: R100.2 21.21,5.3 IC5.1 21.21,8.38 v19.94,8.38 | v18.03,20.32 C40.+
  Bottom 0.406: v19.94,8.38 19.94,13.34 18.03,15.24 18.03,19.69 v18.03,20.32
N$11
  Top 0.406: LED1.AR R35.2
N$12
  Top 0.406: R84.2 15.13,23.23 L3.2
N$13
  Top 0.406: 80.9,61.96 C19.1
  Top 0.61: LCD1.3 80.9,61.96
N$14
  Top 0.406: 79.63,61.96 C19.2
  Top 0.61: LCD1.2 79.63,61.96
N$15
  Top 0.406: R35.1 52.32,44.22 T3.1
N$16
  Top 0.406: LED2.AX 113.28,51.18 112.52,50.42 R38.2
N$17
  Top 0.406: T6.1 112.52,44.2 R38.1
N$18
  Top 0.406: R76.2 14.81,28.31 L2.2
N$19  (via drill 0.5)
  Top 0.508: v10.41,100.46 10.41,101.85 D10.A
  Bottom 0.508: K4.1 8.97,95.3 9.78,94.49 11.43,94.49 12.45,95.5 12.45,98.43 v10.41,100.46
N$20
  Top 0.406: R84.1 15.22,25.02 C40.-
N$21
  Top 0.406: R76.1 16.17,31.37 C37.-
N$22
  Top 0.406: LED3.A 3.46,83.72 R102.2
N$23
  Top 0.406: LED2.AR R37.2
N$24
  Top 0.406: T5.1 108.2,44.2 R37.1
N$25
  Top 0.406: C46.1 47.24,18.69 | 47.24,18.69 48.36,18.69 R86.2 | IC4.10 47.24,18.69
N$26
  Top 0.406: IC5.6 23.75,15.03 R90.1 R88.1
N$27  (via drill 0.5)
  Top 0.406: IC5.7 22.48,15.03 R90.2 v20.57,15.24 | v20.57,27.94 18.03,27.94 C37.+
  Bottom 0.406: v20.57,15.24 v20.57,27.94
N$28
  Top 0.406: R16.1 19.47,79.64 T1.1
N$29
  Top 0.406: IC4.8 49.78,17.15 | 49.78,17.15 50.42,17.78 R87.1 | IC4.9 48.51,16.51 49.15,17.15 49.78,17.15
N$30
  Top 0.406: T2.1 114.53,66.88 R20.1
N$31
  Top 0.61: LCD1.A 113.98,69.9 R20.2
N$33
  Top 0.406: R85.2 44.55,18.84 C45.1 IC4.12
N$34
  Top 0.406: IC4.13 43.43,16.51 42.8,17.15 42.16,17.15 | 42.16,17.15 IC4.14 41.89,15.03 R89.1 R93.1 | C44.2 40.89,17.78 41.53,17.15 42.16,17.15
N$35
  Top 0.406: D1.1 42.53,76.52 S1.E
N$36
  Top 0.406: S2.E 120.94,71.56 D2.1
N$40
  Top 0.406: R97.2 44.7,6.57 | 44.7,6.57 45.82,6.57 C54.1 | IC4.3 44.7,6.57
N$46
  Top 0.406: R66.1 73.91,34.29 72.52,32.9 S5.A 69.55,31.12 65.02,31.12 63.97,32.17 R74.1
N$47
  Top 0.406: S5.B 66.29,32.94 R63.1 64.18,35.34 R71.1 R61.2
N$55
  Top 0.406: R86.1 48.51,22.44 R82.2
N$56
  Top 0.406: R87.2 50.63,20.54 51.69,21.59 51.69,22.65 R83.1
N$57
  Top 0.406: R85.1 42.8,22.65 R81.2
N$58
  Top 0.406: R97.1 44.07,2.96 R101.2
N$59
  Top 0.406: C44.1 40.89,22.44 R81.1 41.53,23.08 41.53,26.04 43.43,27.94 47.88,27.94 50.2,25.62 R83.2
N$60
  Top 0.406: R89.2 38.57,16.73 37.72,15.88 37.72,11.43 | 37.72,11.43 37.72,5.72 38.35,5.08 41.8,5.08 C53.1 41.95,4.5 R101.1 | 37.72,11.43 39.41,11.43 R93.2
N$61
  Top 0.406: C55.- 39.64,3.51 38.04,1.91 12.28,1.91 P1.4
N$62
  Top 0.406: P1.1 5.29,6.35 4.06,6.35 3.43,6.99 3.43,12.07 4.06,12.7 12.95,12.7 19.05,18.8 23.37,18.8 24.38,19.81 C42.-
N$65
  Top 0.406: R92.2 R91.1 29.68,15.51 C47.+ 28.19,15.88 27.56,15.88 25.02,13.34 IC5.5 25.02,10.8 23.75,9.53 IC5.3
N$67
  Top 0.406: IC4.5 47.24,8.26 47.88,7.62 R98.2 R99.1
N$69
  Top 0.406: IC4.6 48.51,8.89 49.15,8.26 49.78,8.26 IC4.7
N$70
  Top 0.406: S3.E 22,50.15 D4.1
N$71
  Top 0.406: D5.1 42.53,29.53 S4.E
N$74
  Top 0.406: D7.1 70.47,22.54 S5.E
N$75
  Top 0.406: D8.1 92.06,20.64 S6.E
N$76
  Top 0.406: D6.1 119.97,27.63 S7.E
N$77
  Top 0.406: D3.1 134.58,51.76 S8.E
N$78
  Top 0.406: S5.C R64.2 R65.2
N$79
  Top 0.406: R6.1 44.7,88.19 S1.A 44.66,87.59 43.43,86.36 38.99,86.36 37.72,87.63 37.72,88.48 R11.1
N$80
  Top 0.406: S1.B 39.62,88.19 R5.1 39.41,90.81 R9.1
N$82
  Top 0.406: R70.1 101.85,34.29 100.58,33.02 99.39,33.02 S6.A 97.49,31.12 92.96,31.12 91.91,32.17 R75.1
N$83
  Top 0.406: R62.2 R72.1 94.02,35.56 R67.1 94.23,32.94 S6.B
N$84
  Top 0.406: S6.C R68.2 R69.2
N$85
  Top 0.406: R8.1 125.94,90.55 S2.A 124.16,86.36 119.63,86.36 118.58,87.42 R12.1
N$86
  Top 0.406: S2.B 120.94,90.55 R7.1 120.69,90.81 R10.1
N$88
  Top 0.406: R57.1 118.58,40.43 119.63,39.37 124.16,39.37 S7.A 126.06,41.28 127.25,41.28 128.52,42.55 R47.1
N$89
  Top 0.406: S7.B 120.94,43.56 R44.1 120.69,43.82 R52.1 R42.2
N$90
  Top 0.406: R46.2 R45.2 S7.C
N$91
  Top 0.406: R24.1 31.37,66.68 30.73,66.04 29.54,64.77 S3.A 29.34,64.65 27.56,62.87 23.11,62.87 22.06,63.92 R31.1
N$92
  Top 0.406: S3.B 24.42,67.06 R21.1 24.17,67.31 R29.1 22.48,67.73 R18.2
N$93
  Top 0.406: S3.C 26.92,64.77 27.24,65.09 R22.2 R23.2
N$94
  Top 0.406: R55.2 28.34,41.7 C30.1 IC3.10
N$95
  Top 0.406: 30.79,38.1 IC3.8 30.73,40.01 | IC3.9 29.46,39.37 30.1,40.01 30.73,40.01 | R56.1 32,40.64 31.37,40.01 30.73,40.01
N$96
  Top 0.406: R54.2 25.65,41.7 | 25.65,41.7 26.14,41.7 C29.1 | IC3.12 25.65,41.7
N$97
  Top 0.406: IC3.13 24.38,39.37 23.75,40.01 23.11,40.01 | 23.11,40.01 IC3.14 22.84,37.89 R60.1 R73.1 | C28.2 22.48,40.64 23.11,40.01
N$98
  Top 0.406: IC3.3 25.65,31.12 26.29,30.48 C39.1 28.04,29.58 R78.2
N$100
  Top 0.406: R55.1 R39.2
N$101
  Top 0.406: R56.2 R40.1
N$102
  Top 0.406: R54.1 24.38,45.3 R41.2
N$103
  Top 0.406: R78.1 R80.2
N$104
  Top 0.406: C28.1 22.48,45.51 | 22.48,45.51 R41.1 | 22.48,45.51 22.48,46.36 23.11,46.99 25.65,46.99 27.24,48.58 31.69,48.58 32,48.26 R40.2
N$105  (via drill 0.5)
  Top 0.406: R60.2 20.15,39.59 19.3,38.73 19.3,34.93 19.94,34.29 20.99,34.29 R73.2 21.21,33.02 v21.84,32.39 | R80.1 28.61,23.5 27.56,23.5 v26.29,24.77 24.38,26.67 C38.1
  Bottom 0.406: v21.84,32.39 21.84,29.21 v26.29,24.77
N$106
  Top 0.406: IC3.5 28.19,31.75 30.1,29.85 R77.1 R79.2
N$107
  Top 0.406: IC3.6 29.46,31.75 30.1,31.12 30.73,31.12 IC3.7
N$108
  Top 0.406: R28.1 143.76,66.04 142.49,64.77 141.3,64.77 S8.A 139.4,62.87 134.87,62.87 133.82,63.92 R32.1
N$109
  Top 0.406: S8.B 136.18,67.06 R25.1 135.93,67.31 R30.1 R19.2
N$110
  Top 0.406: S8.C R26.2 R27.2
N$111
  Top 0.406: R51.1 47.24,42.55 45.97,41.28 44.78,41.28 S4.A 44.58,41.16 43.43,40.01 37.72,40.01 37.3,40.43 R58.1
N$112
  Top 0.406: S4.B 39.66,42.93 R48.1 39.09,43.18 R53.1 R43.2
N$113
  Top 0.406: S4.C R49.2 R50.2
OUT1
  Top 0.406: TP11.TP 4.7,15.24 7.24,17.78 7.24,20.21 K3.T 12.06,25.03 L3.1
OUT2
  Top 0.406: TP9.TP 5.97,24.13 5.97,31.12 7.87,33.02 11.19,33.02 K3.R 12.95,31.26 L2.1
P1AW
  Top 0.406: P1.2 6.6,7.62 C51.-
P1BW
  Top 0.406: C50.- 8.81,9.91 P1.5
PWM1  (via drill 0.5)
  Top 0.254: IC2.34 35.33,61.75 33.91,60.33 v33.91,59.69
  Top 0.406: R39.1 28.09,47.21 TP6.TP
  Bottom 0.406: v33.91,59.69 31.37,59.69 27.88,56.2 TP6.TP
PWM2/SWDIO  (via drill 0.5)
  Top 0.254: IC2.39 39.14,57.31 v38.35,56.52
  Top 0.406: K2.2 70.74,8.26 59.94,19.05 v59.94,22.86 | v49.78,49.53 v49.78,45.72 | R82.1 46.39,23.92 TP7.TP
  Bottom 0.406: v38.35,56.52 39.62,55.25 44.07,55.25 v49.78,49.53 | v49.78,45.72 49.78,39.37 45.97,35.56 45.97,29.85 47.88,27.94 47.88,26.04 TP7.TP 57.4,25.4 v59.94,22.86
ROW0  (via drill 0.5)
  Top 0.254: IC2.18 41.14,72.64 42.16,73.66 44.65,73.66 S1.D
  Top 0.406: v122.81,76.84 119.63,76.84 116.14,73.34 86.93,73.34 85.98,74.3 53.72,74.3 52.77,73.34 49.15,73.34 47.94,74.55 45.57,74.55 S1.D | S3.D 29.42,50.21 27.56,52.07 27.56,59.06 v25.02,61.6 | v20.89,70.93 20.89,72.07 v25.65,76.84
  Bottom 0.406: S2.D 125.94,73.7 v122.81,76.84 | v25.02,61.6 20.89,65.72 v20.89,70.93 | v25.65,76.84 26.61,77.79 40.52,77.79 S1.D
ROW1  (via drill 0.5)
  Top 0.254: IC2.21 39.64,66.02 40.26,65.41 v40.26,64.77
  Bottom 0.406: v40.26,64.77 38.99,63.5 38.99,59.69 37.08,57.79 37.08,55.88 38.35,54.61 38.35,42.55 37.72,41.91 37.72,35.56 38.99,34.29 38.99,32.33 S4.D 44.66,24.49 47.56,21.59 68.14,21.59 S5.D 71.33,15.92 74.55,12.7 95.5,12.7 99.31,16.51 99.31,18.36 S6.D
ROW2  (via drill 0.5)
  Top 0.254: IC2.1 46.18,60.75 v46.29,60.64
  Top 0.406: S11.3 93.52,3.89 95.19,2.22 101.51,2.22 S7.D 125.94,34.91 S8.D
  Bottom 0.406: v46.29,60.64 46.61,60.33 49.78,60.33 52.32,57.79 65.66,57.79 68.83,60.96 81.53,60.96 88.52,60.96 88.84,60.64 108.84,60.64 119.63,49.85 119.63,48.26 120.9,46.99 138.02,46.99 S8.D
RXD  (via drill 0.5)
  Top 0.254: IC2.37 38.14,58.85 38.1,58.8 v35.81,58.8
  Bottom 0.406: v35.81,58.8 35.18,59.44 35.18,60.33 35.81,60.96 35.81,64.77 33.59,66.99 26.61,66.99 18.67,74.93 18.67,80.01 18.03,80.65 14.86,80.65 K1.3
S1A  (via drill 0.5)
  Top 0.254: IC2.2 43.14,61.25 42.16,62.23 42.16,62.99 41.78,63.37 v41.78,64.07 | 39.89,94.62 C6.2
  Top 0.406: C6.2 R5.2 | v49.15,68.9 51.05,70.8 52.96,70.8 v53.91,71.75 | v53.91,85.09 53.91,86.68 45.97,94.62 39.89,94.62
  Bottom 0.406: v41.78,64.07 44.39,66.68 47.24,66.68 49.15,68.58 v49.15,68.9 | v53.91,71.75 v53.91,85.09
S1B  (via drill 0.5)
  Top 0.254: IC2.13 43.64,68.16 47.24,71.75 v47.24,72.71 | 42.31,92.29 C9.2
  Top 0.406: v46.61,89.53 46.61,91.44 45.97,92.08 44.92,92.08 R6.2 42.31,92.29
  Bottom 0.406: v47.24,72.71 47.24,77.79 45.66,79.38 45.66,82.23 46.61,83.19 v46.61,89.53
S2A  (via drill 0.5)
  Top 0.254: IC2.26 35.47,65.75 33.91,67.31 v33.91,71.12
  Top 0.406: R7.2 C7.2 120.63,93.98 115.82,93.98 99.31,77.47 36.13,77.47 v35.18,76.52
  Bottom 0.406: v33.91,71.12 33.91,75.25 v35.18,76.52
S2B  (via drill 0.5)
  Top 0.254: IC2.38 38.64,58.08 v38.35,57.79 | 125.83,92.44 R8.2
  Top 0.406: v67.88,57.47 68.2,57.15 110.74,57.15 111.38,57.79 129.16,57.79 131.7,60.33 142.49,60.33 147.57,65.41 147.57,74.3 129.16,92.71 126.4,92.71 R8.2 | C10.2 125.83,92.44
  Bottom 0.406: v38.35,57.79 38.99,58.42 41.21,58.42 41.53,58.1 46.93,58.1 47.24,58.42 49.15,58.42 51.05,56.52 66.93,56.52 v67.88,57.47
S3A  (via drill 0.5)
  Top 0.254: IC2.10 42.01,65.25 v41.53,65.72
  Top 0.406: R21.2 25.29,69.06 C12.2 25.29,72.34 v25.65,72.71
  Bottom 0.406: v41.53,65.72 41.53,68.26 40.58,69.22 28.83,69.22 v25.65,72.71
S3B  (via drill 0.5)
  Top 0.254: IC2.32 34.43,62.75 v33.91,62.23 | 32.22,68.58 R24.2
  Top 0.406: 30.73,68.8 R24.2 | v33.27,66.04 33.27,67.95 32.64,68.58 32.22,68.58 | C13.2 30.78,68.84 30.73,68.8 | R23.1 30.73,68.8
  Bottom 0.406: v33.91,62.23 33.91,65.41 v33.27,66.04
S4A  (via drill 0.5)
  Top 0.254: IC2.23 38.64,65.75 v38.99,65.41 | 39.62,46.99 39.62,47.26 C26.2
  Top 0.406: R48.2 39.89,44.94 C26.2 | v37.08,47.62 38.99,47.62 39.62,46.99
  Bottom 0.406: v38.99,65.41 37.72,64.14 37.72,59.44 36.45,58.17 36.45,55.25 37.08,54.61 v37.08,47.62
S4B  (via drill 0.5)
  Top 0.254: IC2.33 35.07,62.25 33.78,60.96 32.64,60.96 30.73,59.06 30.73,55.56 v31.37,54.93 | 45.34,47.36 C27.2
  Top 0.406: R51.2 45.34,44.67 | 45.34,44.67 R50.1 | C27.2 45.7,45.03 45.34,44.67 | v33.91,48.9 35.81,48.9 36.45,49.53 44.7,49.53 45.34,48.9 45.34,47.36
  Bottom 0.406: v31.37,54.93 32.64,53.66 32.64,50.17 v33.91,48.9
S5A  (via drill 0.5)
  Top 0.254: IC2.45 42.14,56.54 42.8,55.88 45.97,55.88 v46.61,55.25 | 66.29,39.64 C31.2
  Top 0.406: C31.2 66.29,39.1 R63.2 | v64.71,50.48 66.29,48.9 66.29,39.64
  Bottom 0.406: v46.61,55.25 51.37,50.48 v64.71,50.48
S5B  (via drill 0.5)
  Top 0.254: IC2.35 35.72,61.25 34.93,60.45 34.93,58.04 35.18,57.79 v35.18,54.61 | 72.01,39.73 C32.2
  Top 0.406: R65.1 72.01,37.05 | 72.01,37.05 R66.2 | C32.2 72.37,37.41 72.01,37.05 | v35.18,49.85 35.5,50.17 45.27,50.17 v47.18,48.26 | v72.01,45.72 72.01,39.73
  Bottom 0.406: v35.18,54.61 v35.18,49.85 | v47.18,48.26 53.28,48.26 53.59,47.94 69.79,47.94 v72.01,45.72
S6A  (via drill 0.5)
  Top 0.254: IC2.47 43.14,58.08 43.94,57.28 47.43,57.28 v47.88,56.83 | 94.23,39.64 C33.2
  Top 0.406: C33.2 94.5,37.32 R67.2 | v94.23,45.09 94.23,39.64 | v70.74,54.93 71.06,55.25 92.01,55.25 v92.33,54.93
  Bottom 0.406: v47.88,56.83 49.47,55.25 70.42,55.25 v70.74,54.93 | v92.33,54.93 92.33,46.99 v94.23,45.09
S6B  (via drill 0.5)
  Top 0.254: IC2.40 39.64,57.13 v40.26,56.52 | 99.95,39.73 C34.2
  Top 0.406: R69.1 99.95,37.05 | 99.95,37.05 R70.2 | 99.95,37.05 100.31,37.41 C34.2 R59.2 | v99.95,40.77 99.95,39.73
  Bottom 0.406: v40.26,56.52 44.07,56.52 50.1,50.48 51.05,49.53 70.74,49.53 76.45,43.82 97.41,43.82 99.95,41.28 v99.95,40.77
S7A  (via drill 0.5)
  Top 0.254: IC2.9 46.63,64.75 v47.24,65.41
  Top 0.406: R44.2 121.17,45.57 C24.2 120.9,47.9 v120.9,49.53
  Bottom 0.406: v47.24,65.41 48.51,65.41 49.78,66.68 112.01,66.68 120.9,57.79 v120.9,49.53
S7B
  Top 0.254: IC2.30 32.89,63.75 30.1,60.96 30.1,53.98 31.37,52.71 44.7,52.71 45.02,53.02 47.56,53.02 51.05,56.52 111.38,56.52 112.01,57.15 119,57.15 126.62,49.53 126.62,47.99 C25.2
  Top 0.406: R46.1 126.62,45.3 | 126.62,45.3 R47.2 | C25.2 126.98,45.67 126.62,45.3
S8A
  Top 0.254: C14.2 136.14,71.39 136.14,73.66 133.92,75.88 119.95,75.88 116.78,72.71 86.61,72.71 85.66,73.66 53.91,73.66 52.96,72.71 48.9,72.71 47.69,73.91 46.42,73.91 45.02,72.52 42.29,72.52 41.64,71.87 IC2.17
  Top 0.406: C14.2 136.41,69.06 R25.2
S8B  (via drill 0.5)
  Top 0.254: IC2.42 40.64,58.04 40.89,57.79 v40.9,57.47
  Top 0.406: R27.1 141.86,68.8 | 141.86,68.8 R28.2 144.18,69.22 145.67,69.22 146.3,68.58 146.3,65.41 141.86,60.96 131.06,60.96 128.52,58.42 110.74,58.42 110.11,57.79 70.42,57.79 v70.1,58.1 | C15.2 142.22,69.16 141.86,68.8
  Bottom 0.406: v70.1,58.1 67.88,55.88 50.42,55.88 48.51,57.79 47.56,57.79 47.12,57.34 41.02,57.34 v40.89,57.47 v40.9,57.47
S9/ISP  (via drill 0.5)
  Top 0.254: IC2.4 46.27,62.25 49.72,58.8 v50.04,58.8
  Bottom 0.406: v50.04,58.8 51.69,57.15 66.29,57.15 68.2,59.06 70.74,59.06 72.33,57.47 72.33,51.12 S9.1
SCL  (via drill 0.5)
  Top 0.254: IC2.15 42.64,70.33 43.12,70.8 44.39,70.8 v44.7,70.48
  Top 0.406: R33.2 86.4,61.81 85.98,62.23 LCD1.7 85.98,67.95 v84.07,69.85
  Bottom 0.406: v44.7,70.48 45.34,71.12 50.16,71.12 51.44,69.85 v84.07,69.85
SDA  (via drill 0.5)
  Top 0.254: v43.31,71.75 42.16,70.61 42.16,67.62 IC2.16
  Top 0.406: R34.2 85.13,59.91 84.71,60.33 LCD1.6 84.71,67.95 82.17,70.48 v82.17,71.12
  Bottom 0.406: v82.17,71.12 81.53,70.48 51.82,70.48 50.55,71.75 v43.31,71.75
TXD  (via drill 0.5)
  Top 0.254: IC2.36 36.79,60.16 v36.45,59.82
  Top 0.406: v18.67,86.36 16.76,86.36 14.86,84.45 9.14,84.45 7.87,83.19 K1.1
  Bottom 0.406: v36.45,59.82 36.45,65.41 34.23,67.63 27.24,67.63 19.3,75.56 19.3,85.72 v18.67,86.36
USB_DM
  Top 0.254: IC2.19 40.64,69.47 36.39,73.72 33.21,73.72 18.03,88.9 17.4,88.9 14.22,92.08 14.22,93.71 C8.1
  Top 0.406: R4.2 13.8,94.13 C8.1
USB_DP  (via drill 0.5)
  Top 0.254: IC2.20 40.14,69.33 36.26,73.22 33.08,73.22 22.48,83.82 | v16.13,88.9 16.76,88.27 18.03,88.27 22.48,83.82 | R16.2 21.17,82.51 22.48,83.82
  Top 0.406: C4.1 13.8,99.55 R3.2 v15.49,97.79
  Bottom 0.406: v16.13,88.9 16.13,97.16 v15.49,97.79
USB_VBUS  (via drill 0.5)
  Top 0.254: IC2.14 43.14,69.56 v43.43,69.85
  Top 0.406: v36.45,74.93 33.91,74.93 27.88,80.96 R15.1 26.92,82.55 26.29,83.19 | R13.2 26.29,83.19 | R14.1 v20.57,84.45 | v25.65,83.19 26.29,83.19
  Bottom 0.406: v43.43,69.85 40.89,72.39 38.99,72.39 v36.45,74.93 | v20.57,84.45 22.16,86.04 23.75,86.04 24.38,85.41 24.38,84.45 v25.65,83.19

## Text on the board
Top: TOP
Bottom: BOTTOM
tPlace: +5V | + | + | 3V3 | + | GND | FX32-1 | RED | RED | GND | GREEN | GREEN | PWM1 | ISP | + | + | + | PWM2 | + | + | OUT2 | CH1 | GND | + | J:B synth | OUT1 | + | CH2 | + | + | + | LPCLINK | RESET | SPARE
bPlace: A | C
Bemassung: www.elektor-labs.com | PWR | IN | MIDI | OUT | VOL
tPlate: 9 mm | 9 mm | 9 mm | 9 mm | 5 mm | 5 mm | 10.5 mm | 9 mm | 9 mm | Pink ring: hole of 10.5 mm diameter | 9 mm | 9 mm
bPlate: Side | 3 mm | 15 mm | 15 mm | Green ring: cut in inside of top cover / to a depth of 1.5 mm, not going through | This dimension corresponds to the cover when flattened | 6 mm | PCB mounting holes (6x) | not to be drilled | 7 mm | PCB outline | Top cover